# Altium project Test Board_CC1101(HC49SMD).PrjPcb
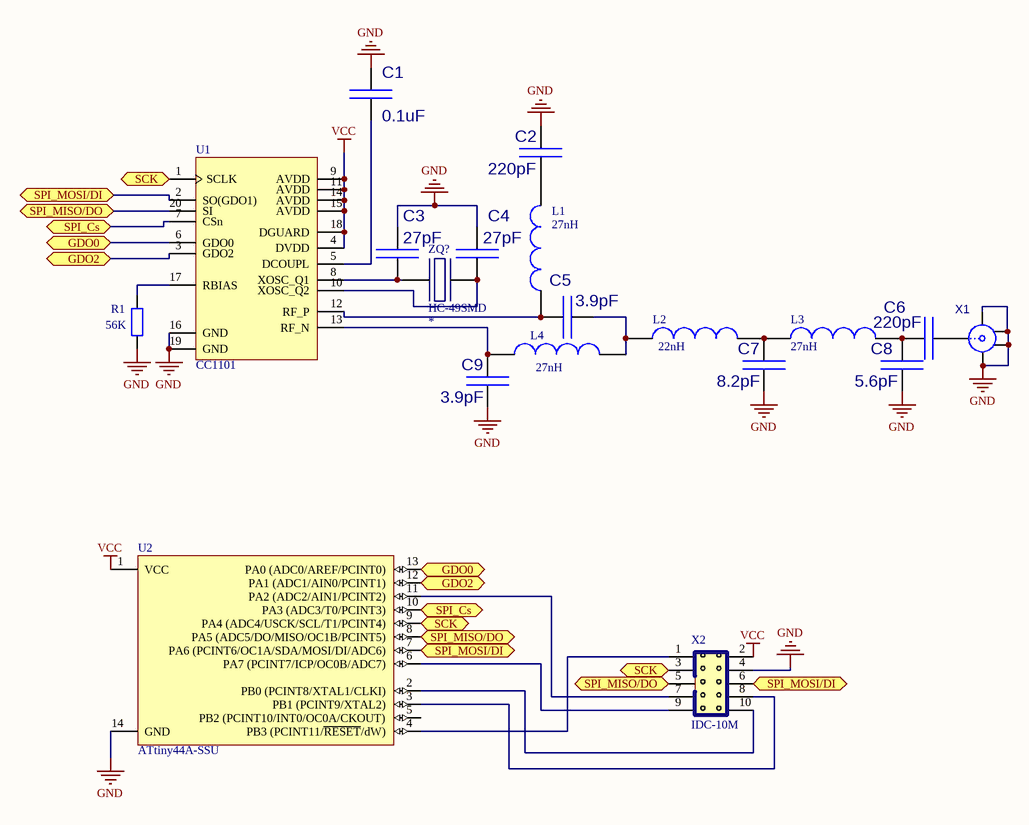
[diagram p0: Test Board_CC1101(HC49SMD).SchDoc]
1 sheet, 19 parts. Net scope: flat (ports and power ports of the same name join across sheets).
Board file: Test Board_CC1101(HC49SMD).PcbDoc

## Sheet Test Board_CC1101(HC49SMD).SchDoc
size A4

### Parts
C1  value 0.1uF  [C0805]  (hidden comment: KONDENS_SMD)
C2  value 220pF  [C0805]  (hidden comment: KONDENS_SMD)
C3  value 27pF  [C0805]  (hidden comment: KONDENS_SMD)
C4  value 27pF  [C0805]  (hidden comment: KONDENS_SMD)
C5  value 3.9pF  [C0805]  (hidden comment: KONDENS_SMD)
C6  value 220pF  [C0805]  (hidden comment: KONDENS_SMD)
C7  value 8.2pF  [C0805]  (hidden comment: KONDENS_SMD)
C8  value 5.6pF  [C0805]  (hidden comment: KONDENS_SMD)
C9  value 3.9pF  [C0805]  (hidden comment: KONDENS_SMD)
L1  value 27nH  [6-0805_M]  (hidden comment: SMD_0805)
L2  value 22nH  [6-0805_M]  (hidden comment: SMD_0805)
L3  value 27nH  [6-0805_M]  (hidden comment: SMD_0805)
L4  value 27nH  [6-0805_M]  (hidden comment: SMD_0805)
R1  value 56K  [C0805]  (hidden comment: RES)
U1  CC1101  [VQFN20]
U2  ATtiny44A-SSU  [14S1_N]
X1  SMA  [SMA]  (value not drawn)
X2  IDC-10M  [IDC-10M]
ZQ?  HC-49SMD  [HC-49SMD]

### Ports
GDO0, GDO2, SCK, SPI_Cs, SPI_MISO/DO, SPI_MOSI/DI

### Nets
GND: C1.1(A) C2.1(A) C3.1(A) C4.1(A) C7.2(B) C8.2(B) C9.2(B) R1.1 U1.16(GND) U1.19(GND) U2.14(GND) X1.2 X1.3 X1.4 X1.5 X2.4
VCC: U1.4(DVDD) U1.9(AVDD) U1.11(AVDD) U1.14(AVDD) U1.15(AVDD) U1.18(DGUARD) U2.1(VCC) X2.2
NetC1_2: C1.2(B) U1.5(DCOUPL)
NetC2_2: C2.2(B) L1.2
NetC3_2: C3.2(B) U1.8(XOSC_Q1) ZQ?.2
NetC4_2: C4.2(B) U1.10(XOSC_Q2) ZQ?.1
NetC5_1: C5.1(A) L1.1 U1.12(RF_P)
NetC5_2: C5.2(B) L2.1 L4.2
NetC6_1: C6.1(A) C8.1(A) L3.2
NetC6_2: C6.2(B) X1.1
NetC7_1: C7.1(A) L2.2 L3.1
NetC9_1: C9.1(A) L4.1 U1.13(RF_N)
NetR1_2: R1.2 U1.17(RBIAS)
NetU1_1: U1.1(SCLK) U2.9(PA4_(ADC4/USCK/SCL/T1/PCINT4)) X2.3 ; port SCK
NetU1_2: U1.2(SO(GDO1)) U2.7(PA6_(PCINT6/OC1A/SDA/MOSI/DI/ADC6)) X2.6 ; port SPI_MOSI/DI
NetU1_3: U1.3(GDO2) U2.12(PA1_(ADC1/AIN0/PCINT1)) ; port GDO2
NetU1_6: U1.6(GDO0) U2.13(PA0_(ADC0/AREF/PCINT0)) ; port GDO0
NetU1_7: U1.7(CSn) U2.10(PA3_(ADC3/T0/PCINT3)) ; port SPI_Cs
NetU1_20: U1.20(SI) U2.8(PA5_(ADC5/DO/MISO/OC1B/PCINT5)) X2.5 ; port SPI_MISO/DO
NetU2_2: U2.2(PB0_(PCINT8/XTAL1/CLKI)) X2.10
NetU2_3: U2.3(PB1_(PCINT9/XTAL2)) X2.8
NetU2_4: U2.4(PB3_(PCINT11/~{RESET}/dW)) X2.1
NetU2_6: U2.6(PA7_(PCINT7/ICP/OC0B/ADC7)) X2.9
NetU2_11: U2.11(PA2_(ADC2/AIN1/PCINT2)) X2.7

Not connected (* = marked no-connect by the designer): U2 5(PB2_(PCINT10/INT0/OC0A/CKOUT))

### Library data of the parts
L1-L4 = Induktor_0805
R1 = RES: Resistor
U2 = ATtiny44A-SSU: 8-bit AVR Microcontroller, 1.8-5.5V, 4KB Flash, 256 Bytes EEPROM, 256 Bytes SRAM, 14-pin SOIC, Industrial Grade (-40°C to 85°C), Pb-Free; Published: 1-Apr-2010; DatasheetVersion: revA, Dec-2008; PackageVersion: revA, Feb-2002; PackageReference: 14S1; Publisher: Altium Limited; PackageDescription: 14-Lead, 0.150” Wide Body, Plastic Gull Wing Small Outline Package (SOIC); Supplier 1: Digi-Key; Supplier Part Number 1: ATTINY44A-SSU-ND; Supplier 2: Farnell; Supplier Part Number 2: 1699397; Supplier 3: Mouser; Supplier Part Number 3: 556-ATTINY44A-SSU; Code_JEDEC: MS-012-AB; Code_IPC: SOIC127P600-14; ComponentLink1Description: Manufacturer Link; ComponentLink1URL: http://www.atmel.com/products/avr/default.asp?; ComponentLink2Description: ATtiny24A/44A Datasheet; ComponentLink2URL: http://www.atmel.com/dyn/resources/prod_documents/doc8183.pdf; ComponentLink3Description: ATtiny24A/44A Summary; ComponentLink3URL: http://www.atmel.com/dyn/resources/prod_documents/8183S.pdf; ComponentLink4Description: Atmel.com Home; ComponentLink4URL: http://www.atmel.com
X1 = SMA: LatestRevisionDate: 17-Jul-2002; Publisher: Altium Limited; LatestRevisionNote: Re-released for DXP Platform.; Value: *
ZQ? = HC-49SMD: Value: *